# Altium project Carrier_Board.PrjPcb
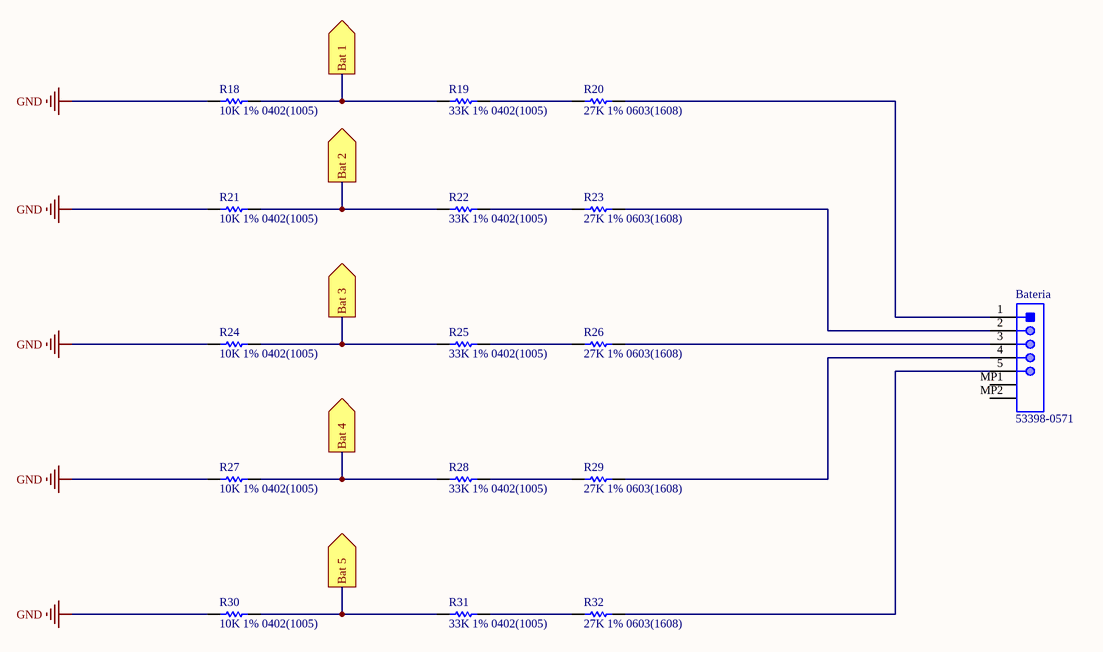
[diagram p0: Medidor bateria.SchDoc]
10 sheets, 82 parts. Net scope: flat (ports and power ports of the same name join across sheets).
Board file: Carrier_Board.PcbDoc
Sheets:
  Medidor bateria.SchDoc
  Carrier_Board.SchDoc
  Recepitor.SchDoc
  ESP8266.SchDoc
  Termistor.SchDoc
  ESC.SchDoc
  MPU 9250.SchDoc
  INA219AID.SchDoc
  Morpheus_conector.SchDoc
  Step Down.schdoc

## Sheet Medidor bateria.SchDoc
size A4

### Parts
(Parts that share a designator on the sheet are numbered #1, #2 ... from top to bottom, then left to right.)
Bateria  53398-0571  [MOLX-53398-0571-5_V]
R18#1  10K 1% 0402(1005)  [RESC0402(1005)_L]
R19#1  33K 1% 0402(1005)  [RESC0402(1005)_L]
R20#1  27K 1% 0603(1608)  [RESC0603(1608)_L]
R21  10K 1% 0402(1005)  [RESC0402(1005)_L]
R22  33K 1% 0402(1005)  [RESC0402(1005)_L]
R23  27K 1% 0603(1608)  [RESC0603(1608)_L]
R24  10K 1% 0402(1005)  [RESC0402(1005)_L]
R25  33K 1% 0402(1005)  [RESC0402(1005)_L]
R26  27K 1% 0603(1608)  [RESC0603(1608)_L]
R27  10K 1% 0402(1005)  [RESC0402(1005)_L]
R28  33K 1% 0402(1005)  [RESC0402(1005)_L]
R29  27K 1% 0603(1608)  [RESC0603(1608)_L]
R30  10K 1% 0402(1005)  [RESC0402(1005)_L]
R31  33K 1% 0402(1005)  [RESC0402(1005)_L]
R32  27K 1% 0603(1608)  [RESC0603(1608)_L]

### Ports
Bat 1 (out), Bat 2 (out), Bat 3 (out), Bat 4 (out), Bat 5 (out)

### Nets
GND: R18#1.1 R21.1 R24.1 R27.1 R30.1
NetBateria_1: Bateria.1 R20#1.2
NetBateria_2: Bateria.2 R23.2
NetBateria_3: Bateria.3 R26.2
NetBateria_4: Bateria.4 R29.2
NetBateria_5: Bateria.5 R32.2
NetR18#1_2: R18#1.2 R19#1.1 ; port Bat 1
NetR19#1_2: R19#1.2 R20#1.1
NetR21_2: R21.2 R22.1 ; port Bat 2
NetR22_2: R22.2 R23.1
NetR24_2: R24.2 R25.1 ; port Bat 3
NetR25_2: R25.2 R26.1
NetR27_2: R27.2 R28.1 ; port Bat 4
NetR28_2: R28.2 R29.1
NetR30_2: R30.2 R31.1 ; port Bat 5
NetR31_2: R31.2 R32.1

Not connected (* = marked no-connect by the designer): Bateria MP1 MP2

### Library data of the parts
Bateria = CMP-2000-05250-1: Male Header, Pitch 1.25 mm, 1 x 5 Postion, Height 4.7 mm, -40 to 85 degC, RoHS, Tape and Reel; Brand: Molex; Number of Positions: 5Position; Mounting Angle: Vertical; Current Rating: 1A; Pitch: 1.25mm; Voltage Rating: 125V; Type: Shrouded; Tradename: PicoBlade; Datasheet Version: Rev. E, 04/2006; Housing Material: Nylon; Datasheet URL: http://www.molex.com/pdm_docs/sd/533980571_sd.pdf; Termination Style: SMD; Contact Gender: Pin(Male); Factory Pack Quantity: 1000; Number of Rows: 1Row; Product: Headers; Package Reference: MOLX-53398-0571-5; Contact Material: PhosphorBronze; RoHS: Details; Manufacturer URL: http://www.molex.com/; Product Category: Headers&WireHousings; Contact Plating: Tin; Manufacturer: Molex; Series: 53398; Packaging: Reel; Mounting Style: SMD
R18#1 R21 R24 R27 R30 = CMP-1011-00623-1: 10K 0.063W 1% 0402 (1005 Metric)  SMD                                         71-CRCW040210K0FKEDC; Case-Metric: 1005; Value: 10000.00 Ohm; Case-EIA: 0402; Tolerance: 1 %; Technology: SMT; Power: 0.063 W
R19#1 R22 R25 R28 R31 = CMP-1011-00680-1: 33K 0.063W 1% 0402 (1005 Metric)  SMD                                 755-SFR01MZPF3302; Value: 33000.00 Ohm; Case-EIA: 0402; Case-Metric: 1005; Power: 0.063 W; Tolerance: 1 %; Technology: SMT
R20#1 R23 R26 R29 R32 = CMP-1012-00670-1: 27K 0.1W 1% 0603 (1608 Metric)  SMD                                      755-ESR03EZPF2702; Case-EIA: 0603; Case-Metric: 1608; Power: 0.250 W; Value: 27000.00 Ohm; Technology: SMT; Tolerance: 1 %

## Sheet Carrier_Board.SchDoc
size A4
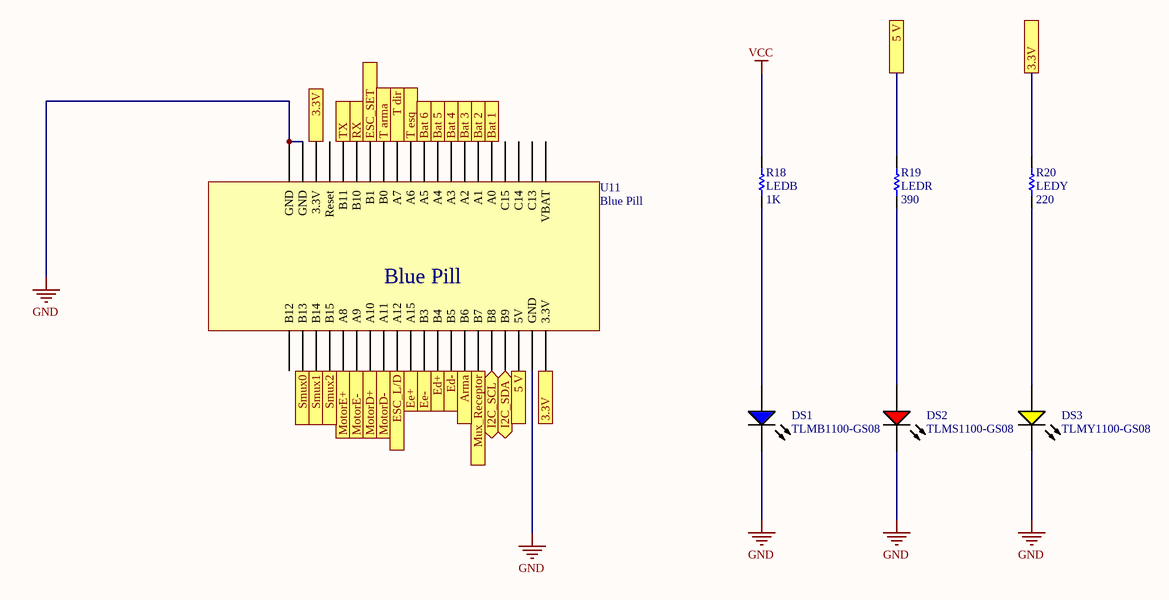
[diagram p1: Carrier_Board.SchDoc]

### Parts
(Parts that share a designator on the sheet are numbered #1, #2 ... from top to bottom, then left to right.)
DS1  TLMB1100-GS08  [VISH-TLMX1100-2_V]
DS2  TLMS1100-GS08  [VISH-TLMX1100_V]
DS3  TLMY1100-GS08  [VISH-TLMX1100-2_V]
R18#2  LEDB  value 1K  [AXIAL-0.3]
R19#2  LEDR  value 390  [AXIAL-0.3]
R20#2  LEDY  value 220  [AXIAL-0.3]
U11  Blue Pill  [blue pill]

### Ports
3.3V, 5 V, Arma (out), Bat 1 (in), Bat 2 (in), Bat 3 (in), Bat 4 (in), Bat 5 (in), Bat 6 (in), Ed+ (in), Ed- (in), Ee+ (in), Ee- (in), ESC_L/D (out), ESC_SET (out), I2C_SCL (bidir), I2C_SDA (bidir), MotorD+ (out), MotorD- (out), MotorE+ (out), MotorE- (out), Mux_Receptor (in), RX, Smux0 (out), Smux1 (out), Smux2 (out), T arma (in), T dir (in), T esq (in), TX

### Nets
GND: DS1.2(K) DS2.2(K) DS3.2(K) U11.?19(GND) U11.?20(GND) U11.?39(GND)
VCC: R18#2.2
NetC2_2: R19#2.2 U11.?38(5V) ; port 5 V
NetC11_1: R20#2.2 U11.?2(3.3V) U11.?40(3.3V) ; port 3.3V
NetDS1_1: DS1.1(A) R18#2.1
NetDS2_1: DS2.1(A) R19#2.1
NetDS3_1: DS3.1(A) R20#2.1
NetESC_2: U11.?34(B6) ; port Arma
NetQ10_1: U11.?15(B1) ; port ESC_SET
NetQ12_1: U11.?29(A12) ; port ESC_L/D
NetR1_1: U11.?37(B9) ; port I2C_SDA
NetR2_1: U11.?36(B8) ; port I2C_SCL
NetR15_1: U11.?14(B0) ; port T arma
NetR16_1: U11.?13(A7) ; port T dir
NetR17_1: U11.?12(A6) ; port T esq
NetR18#1_2: U11.?6(A0) ; port Bat 1
NetR21_2: U11.?7(A1) ; port Bat 2
NetR24_2: U11.?8(A2) ; port Bat 3
NetR27_2: U11.?9(A3) ; port Bat 4
NetR30_2: U11.?10(A4) ; port Bat 5
NetU4_4: U11.?25(A8) ; port MotorE+
NetU4_7: U11.?26(A9) ; port MotorE-
NetU5_4: U11.?27(A10) ; port MotorD+
NetU5_7: U11.?28(A11) ; port MotorD-
NetU9_RX: U11.?16(B10) ; port RX
NetU9_TX: U11.?17(B11) ; port TX
NetU10_5: U11.?35(B7) ; port Mux_Receptor
NetU10_9: U11.?22(B13) ; port Smux0
NetU10_10: U11.?23(B14) ; port Smux1
NetU10_11: U11.?24(B15) ; port Smux2
NetU11_?11: U11.?11(A5) ; port Bat 6
NetU11_?30: U11.?30(A15) ; port Ee+
NetU11_?31: U11.?31(B3) ; port Ee-
NetU11_?32: U11.?32(B4) ; port Ed+
NetU11_?33: U11.?33(B5) ; port Ed-

Not connected (* = marked no-connect by the designer): U11 ?1(VBAT) ?3(C13) ?4(C14) ?5(C15) ?18(Reset) ?21(B12)

### Library data of the parts
DS1 = CMP-1666-00028-1: Blue LED, 10 mA, 3.9 V, -40 to 100 degC, 2-Pin SMD (0603), RoHS, Tape and Reel; Tolerance: 10%; Voltage Rating: 100 V; Capacitance: 10 nF; Type (Capacitors): X7R; Case\Package: Radial; ComponentLink1Description: Manufacturer URL; REACH SVHC: No SVHC; Package Quantity: 500; PackageDescription: 2-Pin Surface Mount Device, Body 1.6 x 0.8 mm; Pins: 2; ComponentLink2URL: http://download.siliconexpert.com/pdfs/2016/8/7/12/43/26/667/vsh_/manual/379263299541529tlmb1100.pdf; RoHSCompliant: true; Lead Pitch: 2.54 mm; Height: 2.54 mm; DatasheetVersion: Rev. 2.7, 03/2016; Length: 5.33 mm; ComponentLink1URL: http://www.vishay.com/; Min Operating Temperature: -55 degC; PackageReference: 0603; Packaging: Bulk; ComponentLink2Description: Datasheet; Max Operating Temperature: 125 degC; Radiation Hardening: No; Width: 3.81 mm; Mount: Through Hole
DS2 = CMP-1666-00027-1: LED, RED, 2.1 V, -40 to 100 degC, 2-Pin SMD (0603), RoHS, Tape and Reel; Type (Capacitors): C0G; Resistance: 100000000000 Ohm; Capacitance: 12 pF; Voltage Rating: 50 V; Tolerance: 5%; Min Operating Temperature: -55degC; REACH SVHC: No SVHC; ComponentLink2Description: Datasheet; ComponentLink1URL: http://www.vishay.com/; Width: 0.8 mm; Package Quantity: 4000; PackageReference: TLMX1100; ComponentLink2URL: http://www.vishay.com/docs/83173/tlmb1100.pdf; Case/Package: 0603; Case Code (Metric): 1608; Packaging: Tape and Reel; Pins: 2; ComponentLink1Description: Manufacturer URL; Max Operating Temperature: 125degC; Height: 0.8 mm; Length: 1.6 mm; Mount: Surface Mount; PackageDescription: 2-Pin Surface Mount Device, Body 1.6 x 0.8 mm; DatasheetVersion: Rev. 2.7, 03/2016; Case Code (Imperial): 0603; Voltage Rating (DC): 50 V; RoHSCompliant: True; Radiation Hardening: No
DS3 = CMP-1666-00030-1: Yellow LED, 20 mA, 2.1 V, -40 to 100 degC, 2-Pin SMD (0603), RoHS, Tape and Reel; ComponentLink2Description: Datasheet; ComponentLink2URL: http://download.siliconexpert.com/pdfs/2016/8/7/12/43/26/667/vsh_/manual/379263299541529tlmb1100.pdf; ComponentLink1Description: Manufacturer URL; PackageDescription: 2-Pin Surface Mount Device, Body 1.6 x 0.8 mm; DatasheetVersion: Rev. 2.7, 03/2016; ComponentLink1URL: http://www.vishay.com/; PackageReference: 0603
R18#2 R19#2 R20#2 = Res1: Resistor; Published: 8-Jun-2000; LatestRevisionDate: 17-Jul-2002; LatestRevisionNote: Re-released for DXP Platform.; PackageReference: AXIAL-0.3; Publisher: Altium Limited; PackageDescription: Axial Device, Thru-Hole; 2 Leads; 0.3 in Pin Spacing

## Sheet Recepitor.SchDoc
size A4
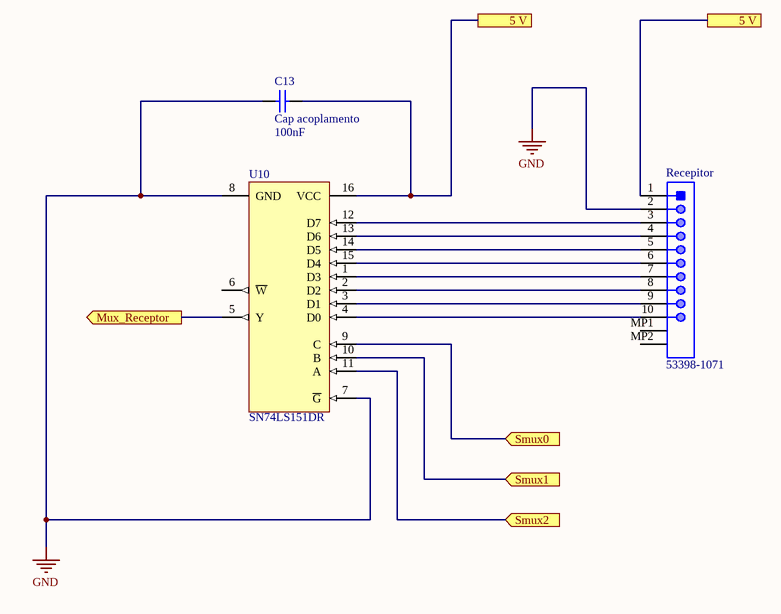
[diagram p2: Recepitor.SchDoc]

### Parts
C13  Cap acoplamento  value 100nF  [C1206]
Recepitor  53398-1071  [MOLX-53398-1071_V]
U10  SN74LS151DR  [D0016A_L]

### Ports
5 V, Mux_Receptor (out), Smux0 (in), Smux1 (in), Smux2 (in)

### Nets
GND: C13.1 Recepitor.2 U10.7(~{G}) U10.8(GND)
NetC2_2: C13.2 Recepitor.1 U10.16(VCC) ; port 5 V
NetRecepitor_3: Recepitor.3 U10.12(D7)
NetRecepitor_4: Recepitor.4 U10.13(D6)
NetRecepitor_5: Recepitor.5 U10.14(D5)
NetRecepitor_6: Recepitor.6 U10.15(D4)
NetRecepitor_7: Recepitor.7 U10.1(D3)
NetRecepitor_8: Recepitor.8 U10.2(D2)
NetRecepitor_9: Recepitor.9 U10.3(D1)
NetRecepitor_10: Recepitor.10 U10.4(D0)
NetU10_5: U10.5(Y) ; port Mux_Receptor
NetU10_9: U10.9(C) ; port Smux0
NetU10_10: U10.10(B) ; port Smux1
NetU10_11: U10.11(A) ; port Smux2

Not connected (* = marked no-connect by the designer): Recepitor MP1 MP2; U10 6(~{W})

### Library data of the parts
C13 = Cap Semi: Capacitor (Semiconductor SIM Model); Published: 8-Jun-2000; LatestRevisionDate: 29-May-2009; LatestRevisionNote: IPC-7351 Footprint Added.; PackageReference: C1206; Publisher: Altium Limited; PackageDescription: Chip Capacitor
Recepitor = CMP-2000-05635-1: Male Header, Pitch 1.25 mm, 1 x 10 Position, Height 4.7 mm, -40 to 85 degC, RoHS, Tape and Reel; Manufacturer: Molex; Mounting Angle: Vertical; Pitch: 1.25mm; Voltage Rating: 125V; Current Rating: 1A; Number of Rows: 1Row; Housing Material: Nylon; Mounting Technology: SurfaceMount; Mounting Style: SMD; Contact Material: PhosphorBronze; Product: Headers; Datasheet URL: http://www.molex.com/pdm_docs/sd/533981071_sd.pdf; Manufacturer URL: http://www.molex.com/; Datasheet Version: Rev. J, 09/2015; Factory Pack Quantity: 1000; Brand: Molex; Packaging: Reel; Product Category: Headers&WireHousings; Contact Gender: Pin(Male); Number of Positions: 10Position; RoHS: Details; Contact Plating: Tin; Package Description: Male Header, Pitch 1.25 mm, 1 x 10 Position, Height 4.7 mm; Series: 53398; Type: Shrouded; Package Reference: 53398-1071; Tradename: PicoBlade; Termination Style: SMD
U10 = CMP-1633-00148-1: 8-Line To 1-Line Data Selectors/Multiplexers, D0016A, LARGE T&R; Manufacturer: Texas Instruments; VCC(Max)(V): 5.25; Configuration: "16","1"; Channels(#): 1; F @ Nom Voltage(Max)(Mhz): 35; Input Type: TTL; Output Drive (IOL/IOH)(Max)(mA): 8/-0.4; Voltage(Nom)(V): 5; Bits(#): 16; VCC(Min)(V): 4.75; Technology Family: LS; tpd @ Nom Voltage(Max)(ns): 38; Function: Encoder/Multiplexer; Schmitt Trigger: No; Rating: Catalog; ICC @ Nom Voltage(Max)(mA): 10; PartNumber: SN74LS151DR; Operating Temperature Range(C): 0 to 70; Type: Standard; ComponentLink3URL: http://www.ti.com/lit/ml/mpds178g/mpds178g.pdf; ComponentLink1Description: Manufacturer URL; ComponentLink2Description: Datasheet; DatasheetVersion: SDLS054; Output Type: TTL; PackageReference: D0016A; ComponentLink1URL: http://www.ti.com/; Code_JEDEC: MS-012 variation AC; ComponentLink2URL: http://www.ti.com/lit/ds/symlink/sn74ls151.pdf; ComponentLink3Description: Package Specification; Generic Part Number: SN74LS151

## Sheet ESP8266.SchDoc
size A4
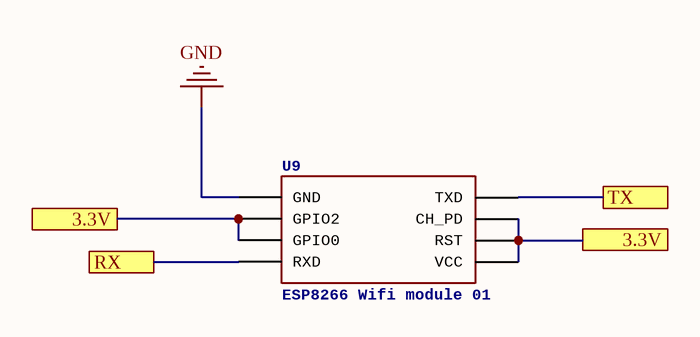
[diagram p3: ESP8266.SchDoc]

### Parts
U9  ESP8266 Wifi module 01  [ESP01]

### Ports
3.3V, RX, TX

### Nets
GND: U9.GND
NetC11_1: U9.CH_PD U9.GPIO0 U9.GPIO2 U9.RST U9.VCC ; port 3.3V
NetU9_RX: U9.RX(RXD) ; port RX
NetU9_TX: U9.TX(TXD) ; port TX

### Library data of the parts
U9 = ESP01: GateName_1: G$1; SymbolName_1: ESP01; LibraryName: esp8266modules; DeviceSetName: ESP01; Package: ESP01

## Sheet Termistor.SchDoc
size A4
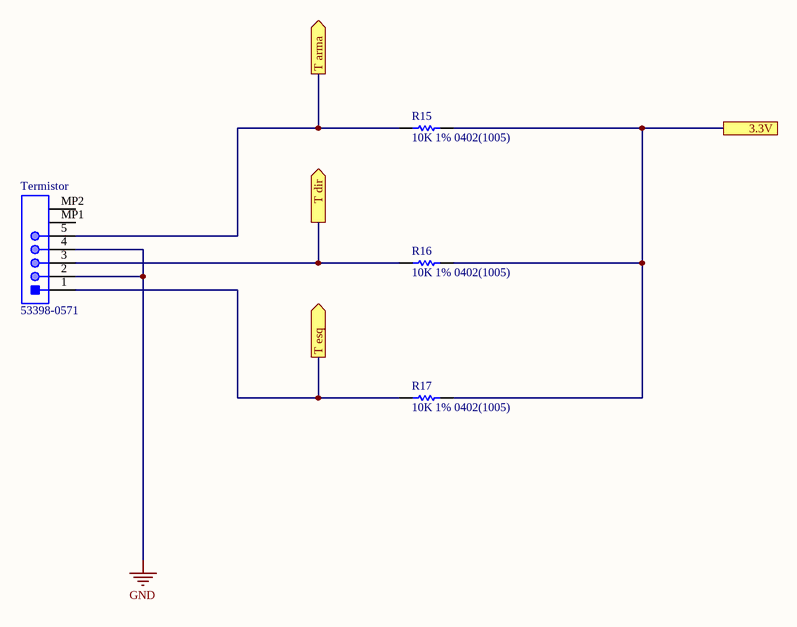
[diagram p4: Termistor.SchDoc]

### Parts
R15  10K 1% 0402(1005)  [RESC0402(1005)_L]
R16  10K 1% 0402(1005)  [RESC0402(1005)_L]
R17  10K 1% 0402(1005)  [RESC0402(1005)_L]
Termistor  53398-0571  [MOLX-53398-0571-5_V]

### Ports
3.3V, T arma (out), T dir (out), T esq (out)

### Nets
GND: Termistor.2 Termistor.4
NetC11_1: R15.2 R16.2 R17.2 ; port 3.3V
NetR15_1: R15.1 Termistor.5 ; port T arma
NetR16_1: R16.1 Termistor.3 ; port T dir
NetR17_1: R17.1 Termistor.1 ; port T esq

Not connected (* = marked no-connect by the designer): Termistor MP1 MP2

### Library data of the parts
R15 = CMP-1011-00623-1: 10K 0.063W 1% 0402 (1005 Metric)  SMD                                    71-CRCW040210K0FKEDC; Case-Metric: 1005; Value: 10000.00 Ohm; Case-EIA: 0402; Tolerance: 1 %; Technology: SMT; Power: 0.063 W
R16 = CMP-1011-00623-1: 10K 0.063W 1% 0402 (1005 Metric)  SMD                                     71-CRCW040210K0FKEDC; Case-Metric: 1005; Value: 10000.00 Ohm; Case-EIA: 0402; Tolerance: 1 %; Technology: SMT; Power: 0.063 W
R17 = CMP-1011-00623-1: 10K 0.063W 1% 0402 (1005 Metric)  SMD                                        71-CRCW040210K0FKEDC; Case-Metric: 1005; Value: 10000.00 Ohm; Case-EIA: 0402; Tolerance: 1 %; Technology: SMT; Power: 0.063 W
Termistor = CMP-2000-05250-1: as Bateria on sheet Medidor bateria; Type: Shrouded; Tradename: PicoBlade; Datasheet Version: Rev. E, 04/2006; Housing Material: Nylon; Datasheet URL: http://www.molex.com/pdm_docs/sd/533980571_sd.pdf; Termination Style: SMD; Contact Gender: Pin(Male); Factory Pack Quantity: 1000; Number of Rows: 1Row; Product: Headers; Package Reference: MOLX-53398-0571-5; Contact Material: PhosphorBronze; RoHS: Details; Manufacturer URL: http://www.molex.com/; Product Category: Headers&WireHousings; Contact Plating: Tin; Manufacturer: Molex; Series: 53398; Packaging: Reel; Mounting Style: SMD

## Sheet ESC.SchDoc
size A4
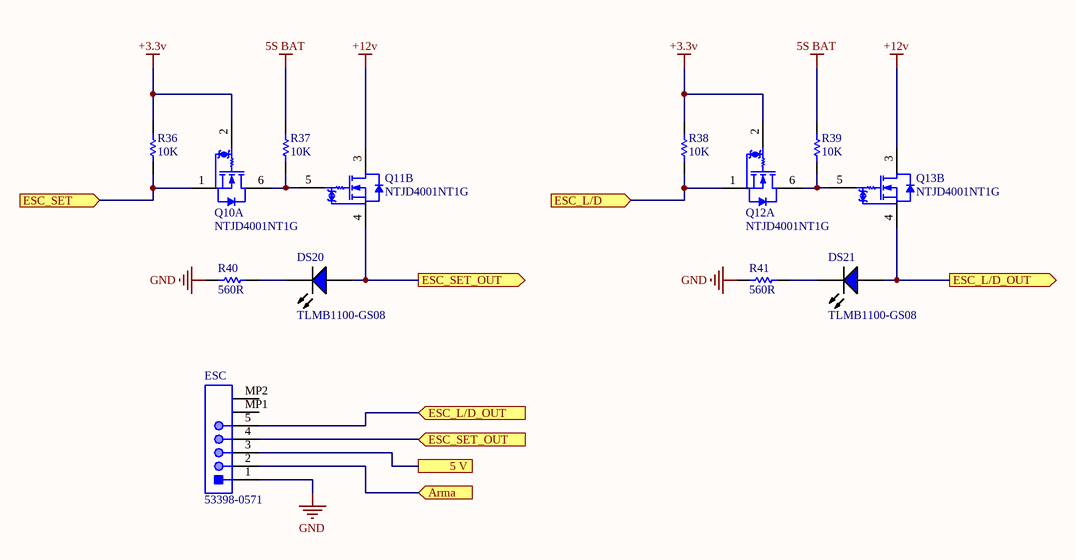
[diagram p5: ESC.SchDoc]

### Parts
DS20  TLMB1100-GS08  [VISH-TLMX1100-2_V]
DS21  TLMB1100-GS08  [VISH-TLMX1100-2_V]
ESC  53398-0571  [MOLX-53398-0571-5_V]
Q10  NTJD4001NT1G  [ONSC-SOT-363-6-419B-02_W_V]  (part A of 2)
Q11  NTJD4001NT1G  [ONSC-SOT-363-6-419B-02_W_V]  (part B of 2)
Q12  NTJD4001NT1G  [ONSC-SOT-363-6-419B-02_W_V]  (part A of 2)
Q13  NTJD4001NT1G  [ONSC-SOT-363-6-419B-02_W_V]  (part B of 2)
R36  value 10K  [RES-0402]  (hidden comment: CRCW040210K0FKEDC)
R37  value 10K  [RES-0402]  (hidden comment: CRCW040210K0FKEDC)
R38  value 10K  [RES-0402]  (hidden comment: CRCW040210K0FKEDC)
R39  value 10K  [RES-0402]  (hidden comment: CRCW040210K0FKEDC)
R40  value 560R  [RES-0402]  (hidden comment: RR0510P-561-D)
R41  value 560R  [RES-0402]  (hidden comment: RR0510P-561-D)

### Ports
5 V, Arma (in), ESC_L/D (in), ESC_L/D_OUT (in), ESC_L/D_OUT (out), ESC_SET (in), ESC_SET_OUT (in), ESC_SET_OUT (out)

### Nets
5S BAT: R37.2 R39.2
+3.3v: Q10.2(G1) Q12.2(G1) R36.2 R38.2
+12v: Q11.3(D2) Q13.3(D2)
GND: ESC.1 R40.1 R41.1
NetC2_2: ESC.3 ; port 5 V
NetDS20_1: DS20.1(A) ESC.4 Q11.4(S2) ; port ESC_SET_OUT
NetDS20_2: DS20.2(K) R40.2
NetDS21_1: DS21.1(A) ESC.5 Q13.4(S2) ; port ESC_L/D_OUT
NetDS21_2: DS21.2(K) R41.2
NetESC_2: ESC.2 ; port Arma
NetQ10_1: Q10.1(S1) R36.1 ; port ESC_SET
NetQ10_6: Q10.6(D1) Q11.5(G2) R37.1
NetQ12_1: Q12.1(S1) R38.1 ; port ESC_L/D
NetQ12_6: Q12.6(D1) Q13.5(G2) R39.1

Not connected (* = marked no-connect by the designer): ESC MP1 MP2

### Library data of the parts
DS20 DS21 = CMP-1666-00028-1: Blue LED, 15 mA, 3.9 V, -40 to 100 degC, 2-Pin SMD (0603), RoHS, Tape and Reel / (https://br.mouser.com/datasheet/2/427/tlmb1100-279843.pdf); Tolerance: 10%; Voltage Rating: 100 V; Capacitance: 10 nF; Type (Capacitors): X7R; Case\Package: Radial; ComponentLink1Description: Manufacturer URL; REACH SVHC: No SVHC; Package Quantity: 500; PackageDescription: 2-Pin Surface Mount Device, Body 1.6 x 0.8 mm; Pins: 2; ComponentLink2URL: http://download.siliconexpert.com/pdfs/2016/8/7/12/43/26/667/vsh_/manual/379263299541529tlmb1100.pdf; RoHSCompliant: true; Lead Pitch: 2.54 mm; Height: 2.54 mm; DatasheetVersion: Rev. 2.7, 03/2016; Length: 5.33 mm; ComponentLink1URL: http://www.vishay.com/; Min Operating Temperature: -55 degC; PackageReference: 0603; Packaging: Bulk; ComponentLink2Description: Datasheet; Max Operating Temperature: 125 degC; Radiation Hardening: No; Width: 3.81 mm; Mount: Through Hole
ESC = CMP-2000-05250-1: Brand: Molex; Number of Positions: 5Position; Mounting Angle: Vertical; Current Rating: 1A; Pitch: 1.25mm; Voltage Rating: 125V; Type: Shrouded; Tradename: PicoBlade; Datasheet Version: Rev. E, 04/2006; Housing Material: Nylon; Datasheet URL: http://www.molex.com/pdm_docs/sd/533980571_sd.pdf; Termination Style: SMD; Contact Gender: Pin(Male); Factory Pack Quantity: 1000; Number of Rows: 1Row; Product: Headers; Package Reference: MOLX-53398-0571-5; Contact Material: PhosphorBronze; RoHS: Details; Manufacturer URL: http://www.molex.com/; Product Category: Headers&WireHousings; Contact Plating: Tin; Manufacturer: Molex; Series: 53398; Packaging: Reel; Mounting Style: SMD
Q10-Q13 = CMP-1058-00809-1: Small Signal MOSFET 30 V, 250 mA, Dual N-Channel, 6-Pin SOT-363, Pb-Free, Tape and Reel / https://www.mouser.com/ProductDetail/ON-Semiconductor/NTJD4001NT1G?qs=%2fha2pyFadugvj01pj2A09QHzF4R5JD3PDyNq%2fIBdLXOX%2fuvmG9BAjA%3d%3d; Manufacturer: On Semiconductor; Crss Typ (pF): 7.25; Channel Polarity: N Channel; Coss Typ (pF): 19; V(BR)DSS Min (V): 30; VGS(th) Max (V): 1.5; PD Max (W): 0.272; VGS Max (V): 20; ID Max (A): 0.25; PackageVersion: Rev. W, 01/2006; ComponentLink3URL: http://www.onsemi.com/pub_link/Collateral/NTJD4001N-D.PDF; RoHS: Pb-Free; Mounting Technology: Surface Mount; ComponentLink1Description: Manufacturer URL; Packing: Tape and Reel; ComponentLink2URL: http://www.onsemi.com/pub_link/Collateral/NTJD4001N-D.PDF; ComponentLink2Description: Datasheet; PartNumber: NTJD4001NT1G; DatasheetVersion: Rev. 6; ComponentLink1URL: http://www.onsemi.com/; Configuration: Dual; PackageDescription: 6-Pin Small Outline Transistor, Body 2 x 1.25 mm, Pitch 0.65 mm; PackageReference: SOT-363-6-419B-02_W; Ciss Typ (pF): 20; ComponentLink3Description: Package Specification; Package Type: SC-88-6 / SC-70-6 / SOT-363-6; PartId: 1
R36-R39 = RES 1K 0402: RES SMD 10K OHM 1% 1/16W 0402 / https://www.mouser.com/ProductDetail/Vishay/CRCW040210K0FKEDC?qs=sGAEpiMZZMu61qfTUdNhG9bvwnXh9sSrBLX2lJMdqZocCF4HyDSLVA%3d%3d
R40 = RES 1K 0402: RES SMD 560R OHM 0.5% 1/16W 0402 / https://br.mouser.com/ProductDetail/Susumu/RR0510P-561-D?qs=%2fha2pyFadugTMkLsGGB9VFT3YMj2FZ4kT7iDoNk9kPzQYUViLqvZAg%3d%3d
R41 = RES 1K 0402: RES SMD 560R OHM 0.5% 1/16W 0402 / https://www.mouser.com/ProductDetail/Vishay/CRCW0402560RFKEDC?qs=sGAEpiMZZMu61qfTUdNhG9bvwnXh9sSraxDhR00SYM54dmU%2f%252bVaaOg%3d%3d

## Sheet MPU 9250.SchDoc
size A4
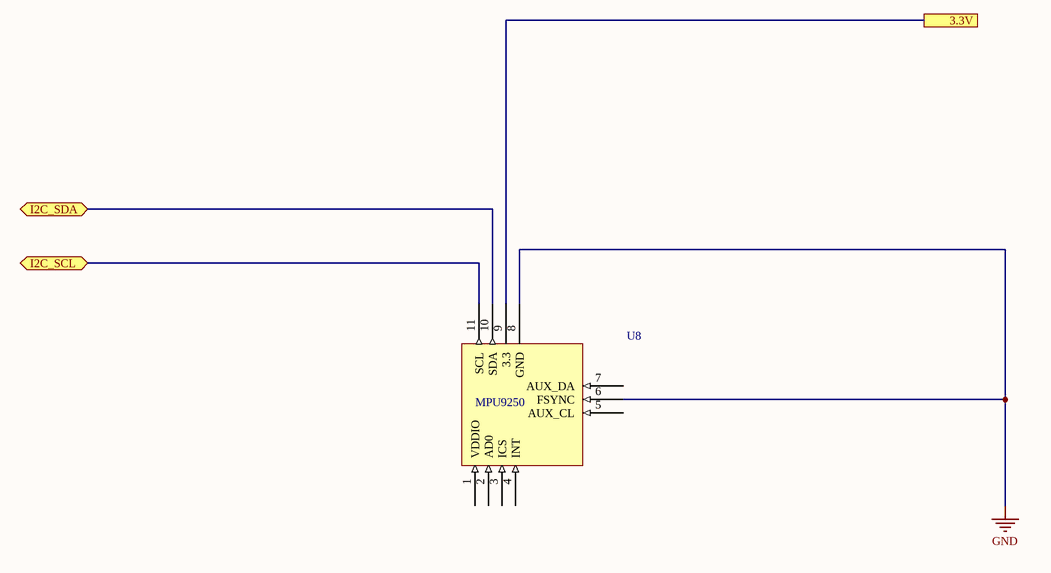
[diagram p6: MPU 9250.SchDoc]

### Parts
U8  (no value)  [MPU-9250_CONECTOR]

### Ports
3.3V, I2C_SCL (bidir), I2C_SDA (bidir)

### Nets
GND: U8.6(FSYNC) U8.8(GND)
NetC11_1: U8.9(3.3) ; port 3.3V
NetR1_1: U8.10(SDA) ; port I2C_SDA
NetR2_1: U8.11(SCL) ; port I2C_SCL

Not connected (* = marked no-connect by the designer): U8 1(VDDIO) 2(AD0) 3(ICS) 4(INT) 5(AUX_CL) 7(AUX_DA)

### Notes on the sheet
- (in symbol U8) MPU9250

### Library data of the parts
U8 = (no symbol name): SPARKFUN MPU9250 GYROSCOPE

## Sheet INA219AID.SchDoc
size A4
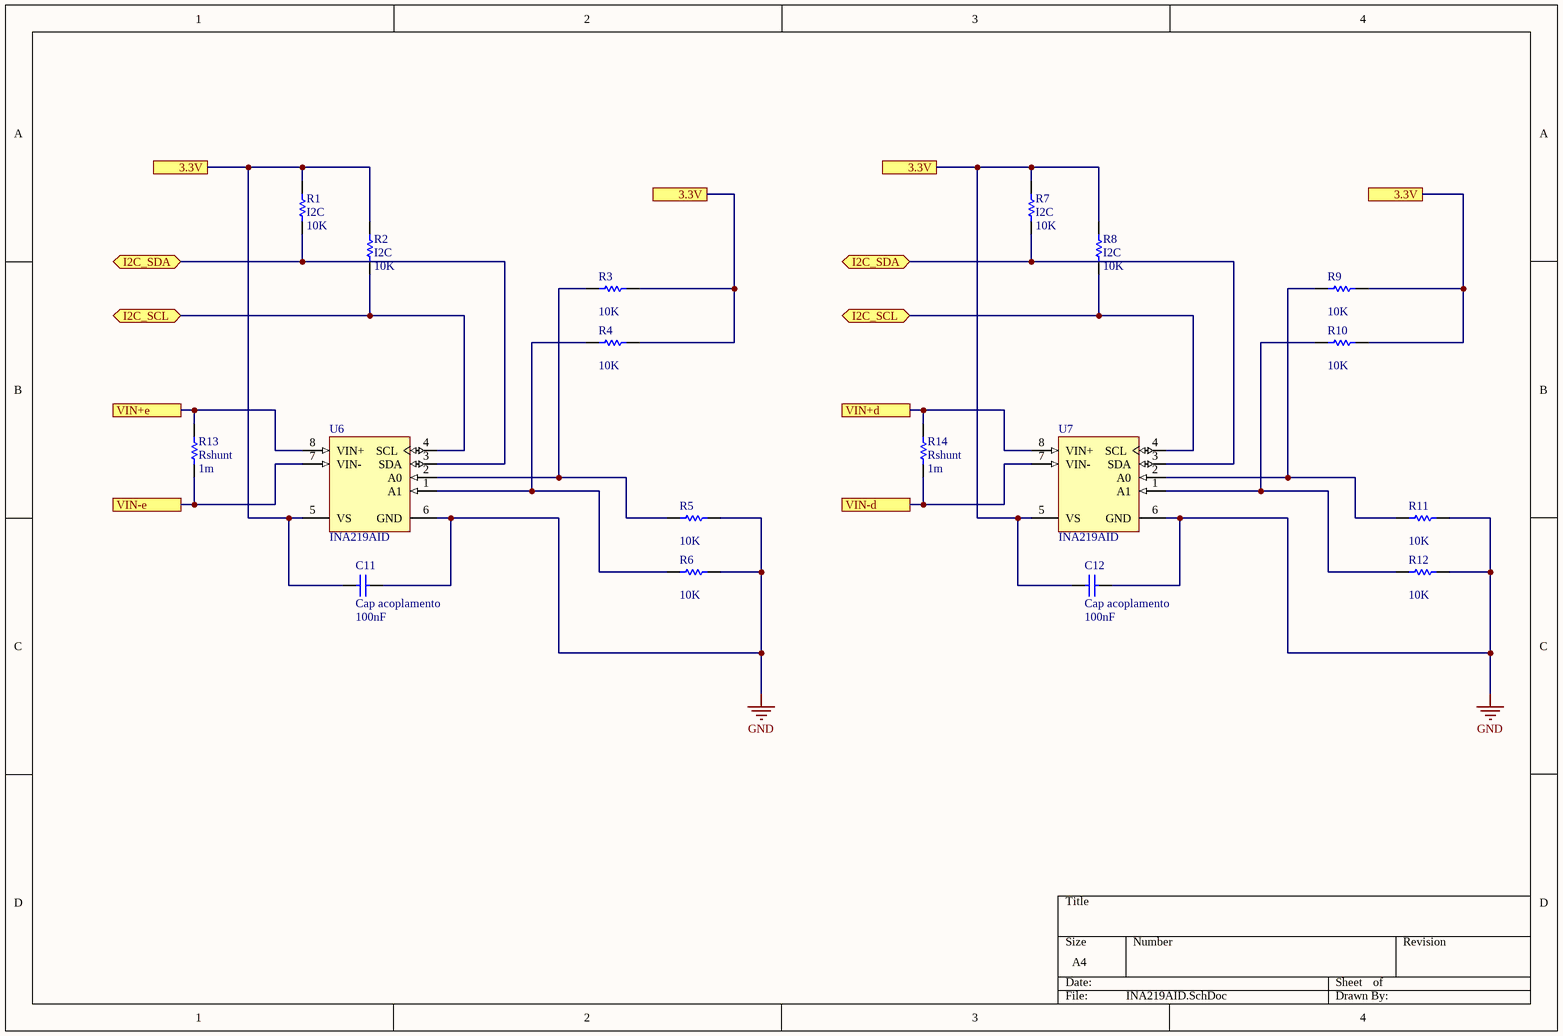
[diagram p7: INA219AID.SchDoc]

### Parts
C11  Cap acoplamento  value 100nF  [C1206]
C12  Cap acoplamento  value 100nF  [C1206]
R1  I2C  value 10K  [AXIAL-0.3]
R2  I2C  value 10K  [AXIAL-0.3]
R3  value 10K  [AXIAL-0.3]  (hidden comment: Res1)
R4  value 10K  [AXIAL-0.3]  (hidden comment: Res1)
R5  value 10K  [AXIAL-0.3]  (hidden comment: Res1)
R6  value 10K  [AXIAL-0.3]  (hidden comment: Res1)
R7  I2C  value 10K  [AXIAL-0.3]
R8  I2C  value 10K  [AXIAL-0.3]
R9  value 10K  [AXIAL-0.3]
R10  value 10K  [AXIAL-0.3]
R11  value 10K  [AXIAL-0.3]
R12  value 10K  [AXIAL-0.3]
R13  Rshunt  value 1m  [AXIAL-0.3]
R14  Rshunt  value 1m  [AXIAL-0.3]
U6  INA219AID  [D0008A_N]
U7  INA219AID  [D0008A_N]

### Ports
3.3V, I2C_SCL (bidir), I2C_SDA (bidir), VIN+d, VIN+e, VIN-d, VIN-e

### Nets
GND: C11.2 C12.2 R5.2 R6.2 R11.2 R12.2 U6.6(GND) U7.6(GND)
VCC: R13.2 R14.2 U6.8(VIN+) U7.8(VIN+) ; port VIN+e, port VIN+d
NetC11_1: C11.1 C12.1 R1.2 R2.2 R3.2 R4.2 R7.2 R8.2 R9.2 R10.2 U6.5(VS) U7.5(VS) ; port 3.3V
NetR1_1: R1.1 R7.1 U6.3(SDA) U7.3(SDA) ; port I2C_SDA
NetR2_1: R2.1 R8.1 U6.4(SCL) U7.4(SCL) ; port I2C_SCL
NetR3_1: R3.1 R5.1 U6.2(A0)
NetR4_1: R4.1 R6.1 U6.1(A1)
NetR9_1: R9.1 R11.1 U7.2(A0)
NetR10_1: R10.1 R12.1 U7.1(A1)
NetR13_1: R13.1 U6.7(VIN-) ; port VIN-e
NetR14_1: R14.1 U7.7(VIN-) ; port VIN-d

### Library data of the parts
C11 C12 = Cap Semi: Capacitor (Semiconductor SIM Model); Published: 8-Jun-2000; LatestRevisionDate: 29-May-2009; LatestRevisionNote: IPC-7351 Footprint Added.; PackageReference: C1206; Publisher: Altium Limited; PackageDescription: Chip Capacitor
R1-R14 = Res1: Resistor; Published: 8-Jun-2000; LatestRevisionDate: 17-Jul-2002; LatestRevisionNote: Re-released for DXP Platform.; PackageReference: AXIAL-0.3; Publisher: Altium Limited; PackageDescription: Axial Device, Thru-Hole; 2 Leads; 0.3 in Pin Spacing
U6 U7 = CMP-0704-00006-2: Zero-Drift, Bi-Directional Current / Power Monitor, 3 to 5.5 V, -40 to 125 degC, 8-pin SOIC (D8), Green (RoHS & no Sb/Br); Manufacturer: Texas Instruments; Vs(Max)(V): 5.5; Rating: Catalog; Gain(V/V): 1, 0.5, 0.25, 0.125; Vs(Min)(V): 3; Common Mode Range(Max)(V): 26; Input Offset (+/-)(Max)(uV): 100; Small-Signal Bandwidth(Typ)(MHz): 0.011; SubFamily: Current Shunt Monitor; Common Mode Range(Min)(V): 0; Quiescent Current (+/-)(Typ)(mA): 0.7; PartNumber: INA219AID; ComponentLink2Description: Datasheet; PackageVersion: 4040047-3/M, 06/2011; ComponentLink3Description: Package Specification; Mounting Technology: Surface Mount; ComponentLink2URL: http://www.ti.com/general/docs/lit/getliterature.tsp?genericPartNumber=INA219&fileType=pdf; Eco-Plan: Green (RoHS & no Sb/Br); DatasheetVersion: SBOS448F; Code_JEDEC: MS-012; PackageDescription: 8-Pin Plastic Small Outline, Body 4.9 x 3.9 mm, Pitch 1.27 mm; ComponentLink1Description: Manufacturer URL; ComponentLink1URL: http://www.ti.com/; PackageReference: D0008A; ComponentLink3URL: http://www.ti.com/lit/ml/msoi002j/msoi002j.pdf; CMRR(Min)(dB): 100

## Sheet Morpheus_conector.SchDoc
size A4
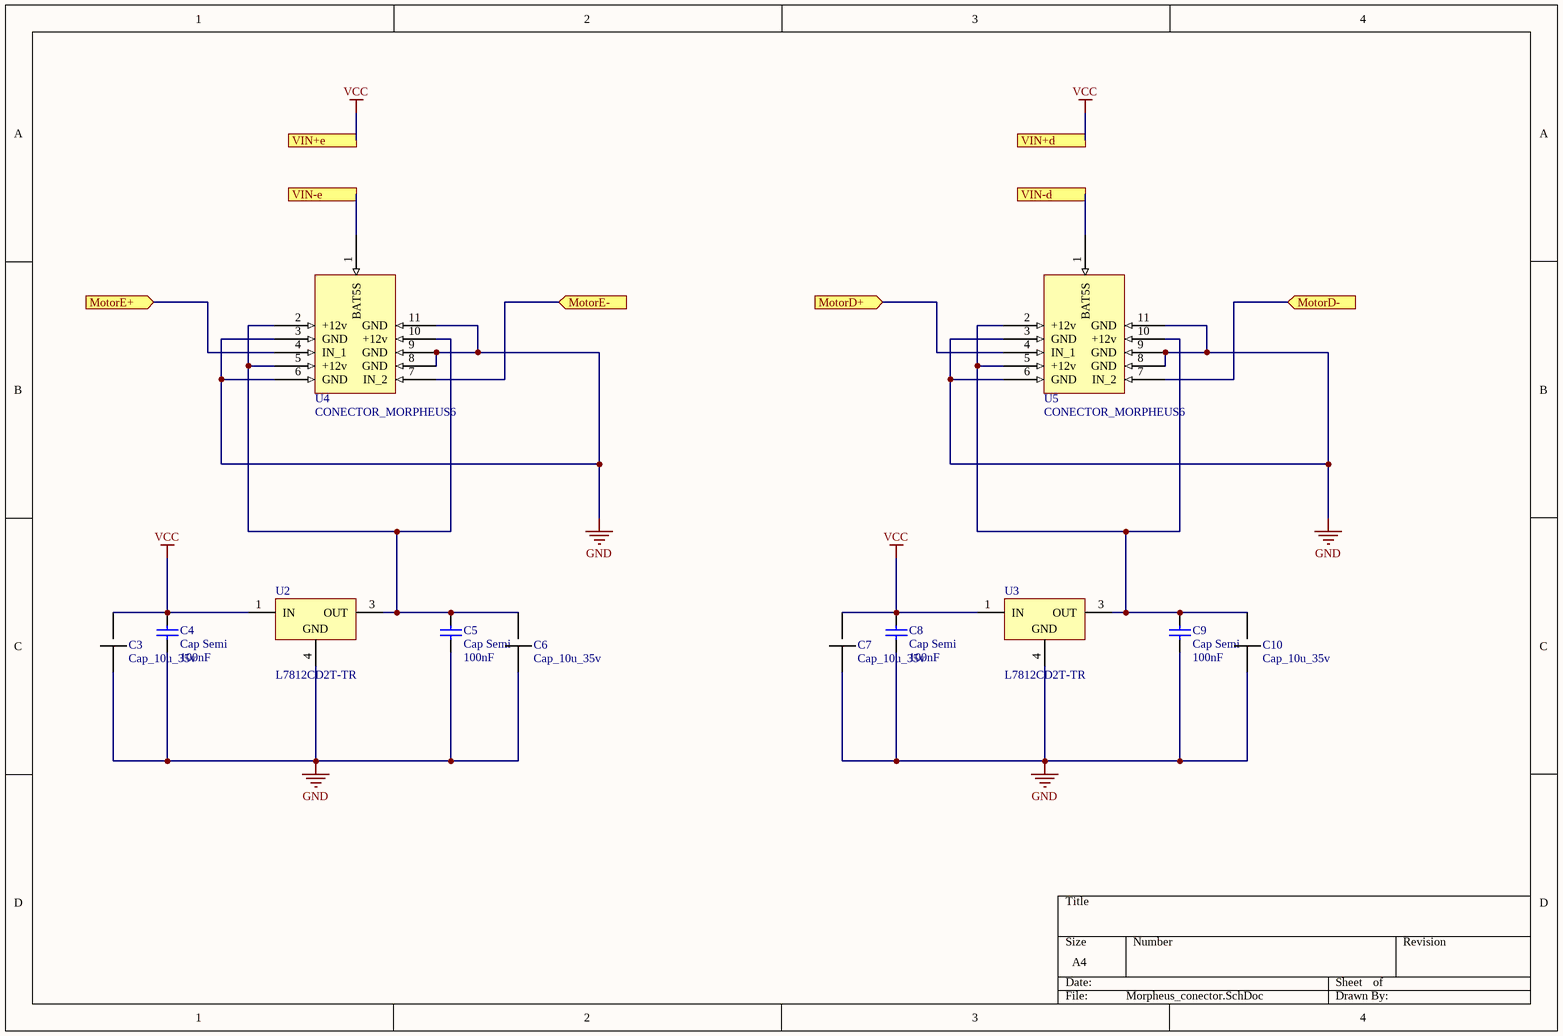
[diagram p8: Morpheus_conector.SchDoc]

### Parts
C3  Cap_10u_35v  [CAP POL 2917/7343]
C4  Cap Semi  value 100nF  [C1206]
C5  Cap Semi  value 100nF  [C1206]
C6  Cap_10u_35v  [CAP POL 2917/7343]
C7  Cap_10u_35v  [CAP POL 2917/7343]
C8  Cap Semi  value 100nF  [C1206]
C9  Cap Semi  value 100nF  [C1206]
C10  Cap_10u_35v  [CAP POL 2917/7343]
U2  L7812CD2T-TR  [TO-263_N]
U3  L7812CD2T-TR  [TO-263_N]
U4  CONECTOR_MORPHEUS6
U5  CONECTOR_MORPHEUS6

### Ports
MotorD+ (in), MotorD- (in), MotorE+ (in), MotorE- (in), VIN+d, VIN+e, VIN-d, VIN-e

### Nets
GND: C3.1 C4.1 C5.1 C6.1 C7.1 C8.1 C9.1 C10.1 U2.4(GND) U3.4(GND) U4.3(GND) U4.6(GND) U4.8(GND) U4.9(GND) U4.11(GND) U5.3(GND) U5.6(GND) U5.8(GND) U5.9(GND) U5.11(GND)
VCC: C3.2 C4.2 C7.2 C8.2 U2.1(IN) U3.1(IN) ; port VIN+e, port VIN+d
NetC5_2: C5.2 C6.2 U2.3(OUT) U4.2(+12v) U4.5(+12v) U4.10(+12v)
NetC9_2: C9.2 C10.2 U3.3(OUT) U5.2(+12v) U5.5(+12v) U5.10(+12v)
NetR13_1: U4.1(BAT5S) ; port VIN-e
NetR14_1: U5.1(BAT5S) ; port VIN-d
NetU4_4: U4.4(IN_1) ; port MotorE+
NetU4_7: U4.7(IN_2) ; port MotorE-
NetU5_4: U5.4(IN_1) ; port MotorD+
NetU5_7: U5.7(IN_2) ; port MotorD-

### Library data of the parts
C4 C5 C8 C9 = Cap Semi: Capacitor (Semiconductor SIM Model); Published: 8-Jun-2000; LatestRevisionDate: 29-May-2009; LatestRevisionNote: IPC-7351 Footprint Added.; PackageReference: C1206; Publisher: Altium Limited; PackageDescription: Chip Capacitor
U2 U3 = CMP-0244-00182-1: Positive Voltage Regulator, 3-Pin D2PAK, Tape and Reel; PackageDescription: 3-Pin Transistor Outline Package 2.54 mm Pitch, 15.4 mm Lead Span (D2PAK); ComponentLink1Description: Manufacturer URL; PackageReference: TO-263; DatasheetVersion: 16/11/2011; ComponentLink2URL: http://www.st.com/internet/com/TECHNICAL_RESOURCES/TECHNICAL_LITERATURE/DATASHEET/CD00000444.pdf; ComponentLink1URL: http://www.st.com; PackageVersion: 2011; ComponentLink2Description: Datasheet

## Sheet Step Down.schdoc
size 223 x 139 mm; SheetNumber: 1; SheetTotal: 1
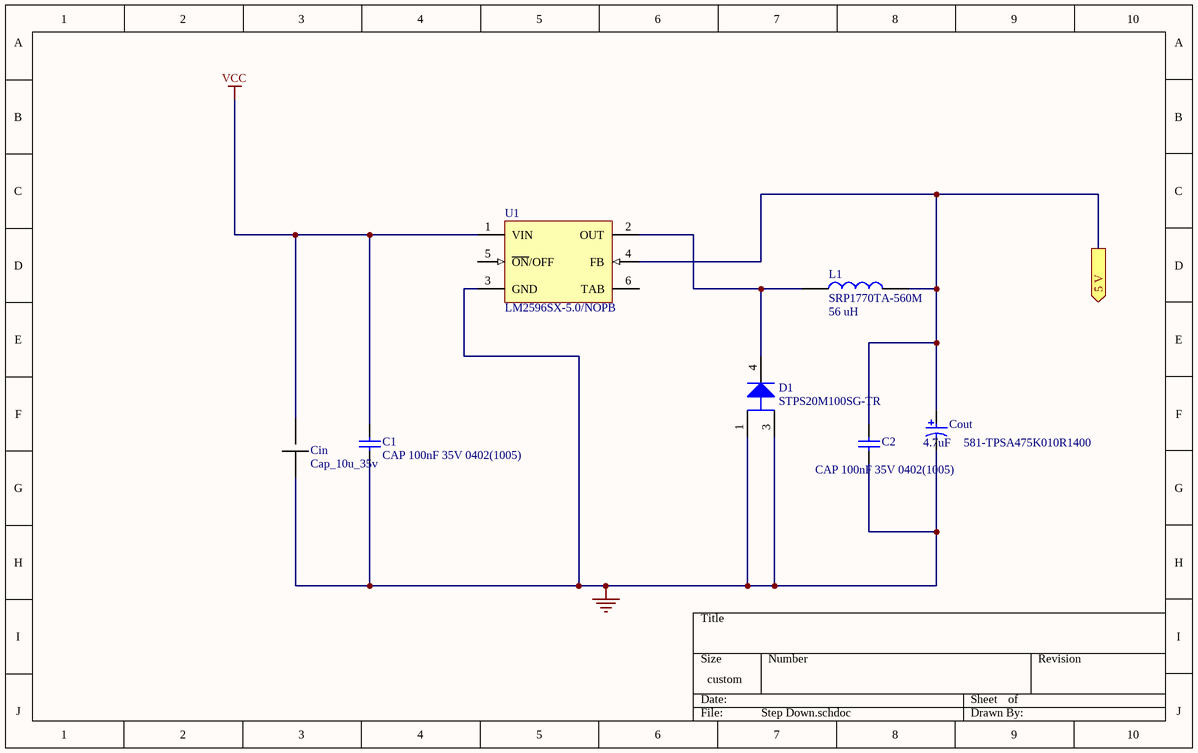
[diagram p9: Step Down.schdoc]

### Parts
C1  CAP 100nF 35V 0402(1005)  [CAPC0402(1005)60_N]
C2  CAP 100nF 35V 0402(1005)  [CAPC0402(1005)60_N]
Cin  Cap_10u_35v  [CAP POL 2917/7343]
Cout  581-TPSA475K010R1400  Capacitancia: 4.7uF  [AVX-TAJ-A-2_L]
D1  STPS20M100SG-TR  [ONSC-D2PAK-3-418B-04_J_V]
L1  SRP1770TA-560M  Indutancia: 56 uH  [INDPM173169X700N]
U1  LM2596SX-5.0/NOPB  [TS5B_M]

### Ports
5 V (out)

### Nets
0: C1.1 C2.1 Cin.1 Cout.2 D1.1(A) D1.3(A) U1.3(GND)
VCC: C1.2 Cin.2 U1.1(VIN)
NetC2_2: C2.2 Cout.1 L1.2 U1.4(FB) ; port 5 V
NetD1_4: D1.4(K) L1.1 U1.2(OUT)

Not connected (* = marked no-connect by the designer): U1 5(~{ON}/OFF) 6(TAB)

### Library data of the parts
C1 = CMP-1034-02076-1: CAP 100nF 35V ±20% 0402 (1005 Metric) Thickness 0.6mm SMD                                                  963-GMK105BJ104MV-F; Case-Metric: 1005; Tolerance: Â±20%; Case-EIA: 0402; Rated Voltage: 35 V; Max Thickness: 0.6 mm; Value: 100nF; Technology: SMT
C2 = CMP-1034-02076-1: CAP 100nF 35V ±20% 0402 (1005 Metric) Thickness 0.6mm SMD                                                 963-GMK105BJ104MV-F; Case-Metric: 1005; Tolerance: Â±20%; Case-EIA: 0402; Rated Voltage: 35 V; Max Thickness: 0.6 mm; Value: 100nF; Technology: SMT
Cin = Cap_10u_35v: 80-T491D106M35AT7280
Cout = CMP-2100-03687-1: Standard Tantalum, 4.7 uF, +/- 10%, 10 V, -55 to 125 degC, 2-Pin SMD (1206), RoHS, Tape and Reel     581-TPSA475K010R1400; Manufacturer: AVX; Dissipation Factor: 6%; Voltage Rating: 10V; Polarity: Polar; Resistance: 4Ohm; Leakage Current: 800nA; Lead Free: LeadFree; Radiation Hardening: No; Depth: 1.6mm; Package Description: 2-Pin Surface Mount Device, Body 3.2 x 1.65 mm; Package Quantity: 1; Max Operating Temperature: 125degC; Case/Package: 1206; Min Operating Temperature: -55degC; Datasheet URL: https://br.mouser.com/datasheet/2/40/tps-776850.pdf; Termination: SMD/SMT; Length: 3.2mm; Height - Seated (Max): 0.071inch; Packaging: TapeandReel; Package Reference: TPS-A-475; RoHSCompliant: True; Datasheet Version: 42401.0; Voltage Rating (DC): 10V; REACH SVHC: NoSVHC; ESR (Equivalent Series Resistance): 4Ohm; Tolerance: 10%; Case Code (Metric): 3216; Voltage: 10V; Height: 1.6mm; Number of Pins: 2; Lead Pitch: 1.1mm; Dielectric Material: Tantalum; Case Code (Imperial): 1206; Width: 1.6mm; Capacitance: 4.7uF
D1 = CMP-1055-00080-1: SWITCHMODE(TM) Power Rectifier ORing Function Diode, 3-Pin D2PAK, Tape and Reel; Manufacturer: On Semiconductor; Configuration: Single; IFSM Max (A): 150; Voltagem: 455mV; PartNumber: STPS20M100SG-TR; PackageReference: D2PAK-3-418B-04_J; DatasheetVersion: Rev. 6; ComponentLink2URL: http://www.onsemi.cn/pub_link/Collateral/MBRB2515L-D.PDF; RoHS: FALSE; ComponentLink2Description: Datasheet; PackageDescription: 3-Pin D2PAK, Body 9.145 x 9.97 mm, Pitch 2.54 mm; ComponentLink1URL: http://www.onsemi.com/; Mounting Technology: Surface Mount; ComponentLink3Description: Package Specification; Packing: Tape and Reel; PackageVersion: Rev. J, 08/2004; ComponentLink1Description: Manufacturer URL; ComponentLink3URL: http://www.onsemi.com/pub_link/Collateral/BUB323Z-D.PDF
L1 = SRP1770TA-560M: Shielded Power Inductor SMD 56uH Bourns SRP1770TA Series Shielded Wire-wound SMD Inductor with a Carbonyl Powder Core, 56 H Wire-Wound 7.8A Idc Q:20; Geometry.Height: 7mm; Manufacturer_Part_Number: SRP1770TA-560M; RS Part Number: 9054781; RS Price/Stock: http://uk.rs-online.com/web/p/products/9054781; Arrow Part Number: SRP1770TA-560M; Arrow Price/Stock: https://www.arrow.com/en/products/srp1770ta-560m/bourns; Datasheet Link: http://docs-europe.electrocomponents.com/webdocs/1465/0900766b81465c8d.pdf; Manufacturer_Name: Bourns
U1 = CMP-0069-00282-2: SIMPLE SWITCHER® Power Converter 150 KHz 3A Step-Down Voltage Regulator, 5-pin TO-263; Manufacturer: Texas Instruments; PowerWise: N; PackageTopMarking: NSUZXYTTE#*LM2596S*-5.0 P+; RevisionNote: Component URLs added; ComponentLink3URL: http://www.national.com/packaging/folders/ts5b.html; Code_JEDEC: MO-169-AB; ComponentLink1Description: LM2596 Datasheet; DatasheetVersion: May-2002; ComponentLink2Description: LM2596 Web Page; PackageReference: TS5B; PackageDescription: TO-263, Molded, .400 x .390 x .180in, 5 Lead, .067in Pitch, Surface Mount; CompType: Switcher; ComponentLink1URL: http://www.national.com/ds/LM/LM2596.pdf; ComponentLink3Description: TS5B Package Page; PinCount: 5; RoHS: N; ComponentLink2URL: http://www.national.com/pf/LM/LM2596.html

## Nets that join several sheets
GND: Medidor bateria (5 pins), Carrier_Board (6 pins), Recepitor (C13.1 Recepitor.2 U10.7 U10.8), ESP8266 (U9.GND), Termistor (Termistor.2 Termistor.4), ESC (ESC.1 R40.1 R41.1), MPU 9250 (U8.6 U8.8), INA219AID (8 pins), Morpheus_conector (20 pins)
VCC: Carrier_Board (R18#2.2), INA219AID (R13.2 R14.2 U6.8 U7.8), Morpheus_conector (6 pins), Step Down (C1.2 Cin.2 U1.1)
NetC2_2: Carrier_Board (R19#2.2 U11.?38), Recepitor (C13.2 Recepitor.1 U10.16), ESC (ESC.3), Step Down (C2.2 Cout.1 L1.2 U1.4)
NetC11_1: Carrier_Board (R20#2.2 U11.?2 U11.?40), ESP8266 (5 pins), Termistor (R15.2 R16.2 R17.2), MPU 9250 (U8.9), INA219AID (12 pins)
NetESC_2: Carrier_Board (U11.?34), ESC (ESC.2)
NetQ10_1: Carrier_Board (U11.?15), ESC (Q10.1 R36.1)
NetQ12_1: Carrier_Board (U11.?29), ESC (Q12.1 R38.1)
NetR1_1: Carrier_Board (U11.?37), MPU 9250 (U8.10), INA219AID (R1.1 R7.1 U6.3 U7.3)
NetR2_1: Carrier_Board (U11.?36), MPU 9250 (U8.11), INA219AID (R2.1 R8.1 U6.4 U7.4)
NetR13_1: INA219AID (R13.1 U6.7), Morpheus_conector (U4.1)
NetR14_1: INA219AID (R14.1 U7.7), Morpheus_conector (U5.1)
NetR15_1: Carrier_Board (U11.?14), Termistor (R15.1 Termistor.5)
NetR16_1: Carrier_Board (U11.?13), Termistor (R16.1 Termistor.3)
NetR17_1: Carrier_Board (U11.?12), Termistor (R17.1 Termistor.1)
NetR18#1_2: Medidor bateria (R18#1.2 R19#1.1), Carrier_Board (U11.?6)
NetR21_2: Medidor bateria (R21.2 R22.1), Carrier_Board (U11.?7)
NetR24_2: Medidor bateria (R24.2 R25.1), Carrier_Board (U11.?8)
NetR27_2: Medidor bateria (R27.2 R28.1), Carrier_Board (U11.?9)
NetR30_2: Medidor bateria (R30.2 R31.1), Carrier_Board (U11.?10)
NetU4_4: Carrier_Board (U11.?25), Morpheus_conector (U4.4)
NetU4_7: Carrier_Board (U11.?26), Morpheus_conector (U4.7)
NetU5_4: Carrier_Board (U11.?27), Morpheus_conector (U5.4)
NetU5_7: Carrier_Board (U11.?28), Morpheus_conector (U5.7)
NetU9_RX: Carrier_Board (U11.?16), ESP8266 (U9.RX)
NetU9_TX: Carrier_Board (U11.?17), ESP8266 (U9.TX)
NetU10_5: Carrier_Board (U11.?35), Recepitor (U10.5)
NetU10_9: Carrier_Board (U11.?22), Recepitor (U10.9)
NetU10_10: Carrier_Board (U11.?23), Recepitor (U10.10)
NetU10_11: Carrier_Board (U11.?24), Recepitor (U10.11)